# EAGLE schematic adapter_1x1 (EAGLE 6.5.0)
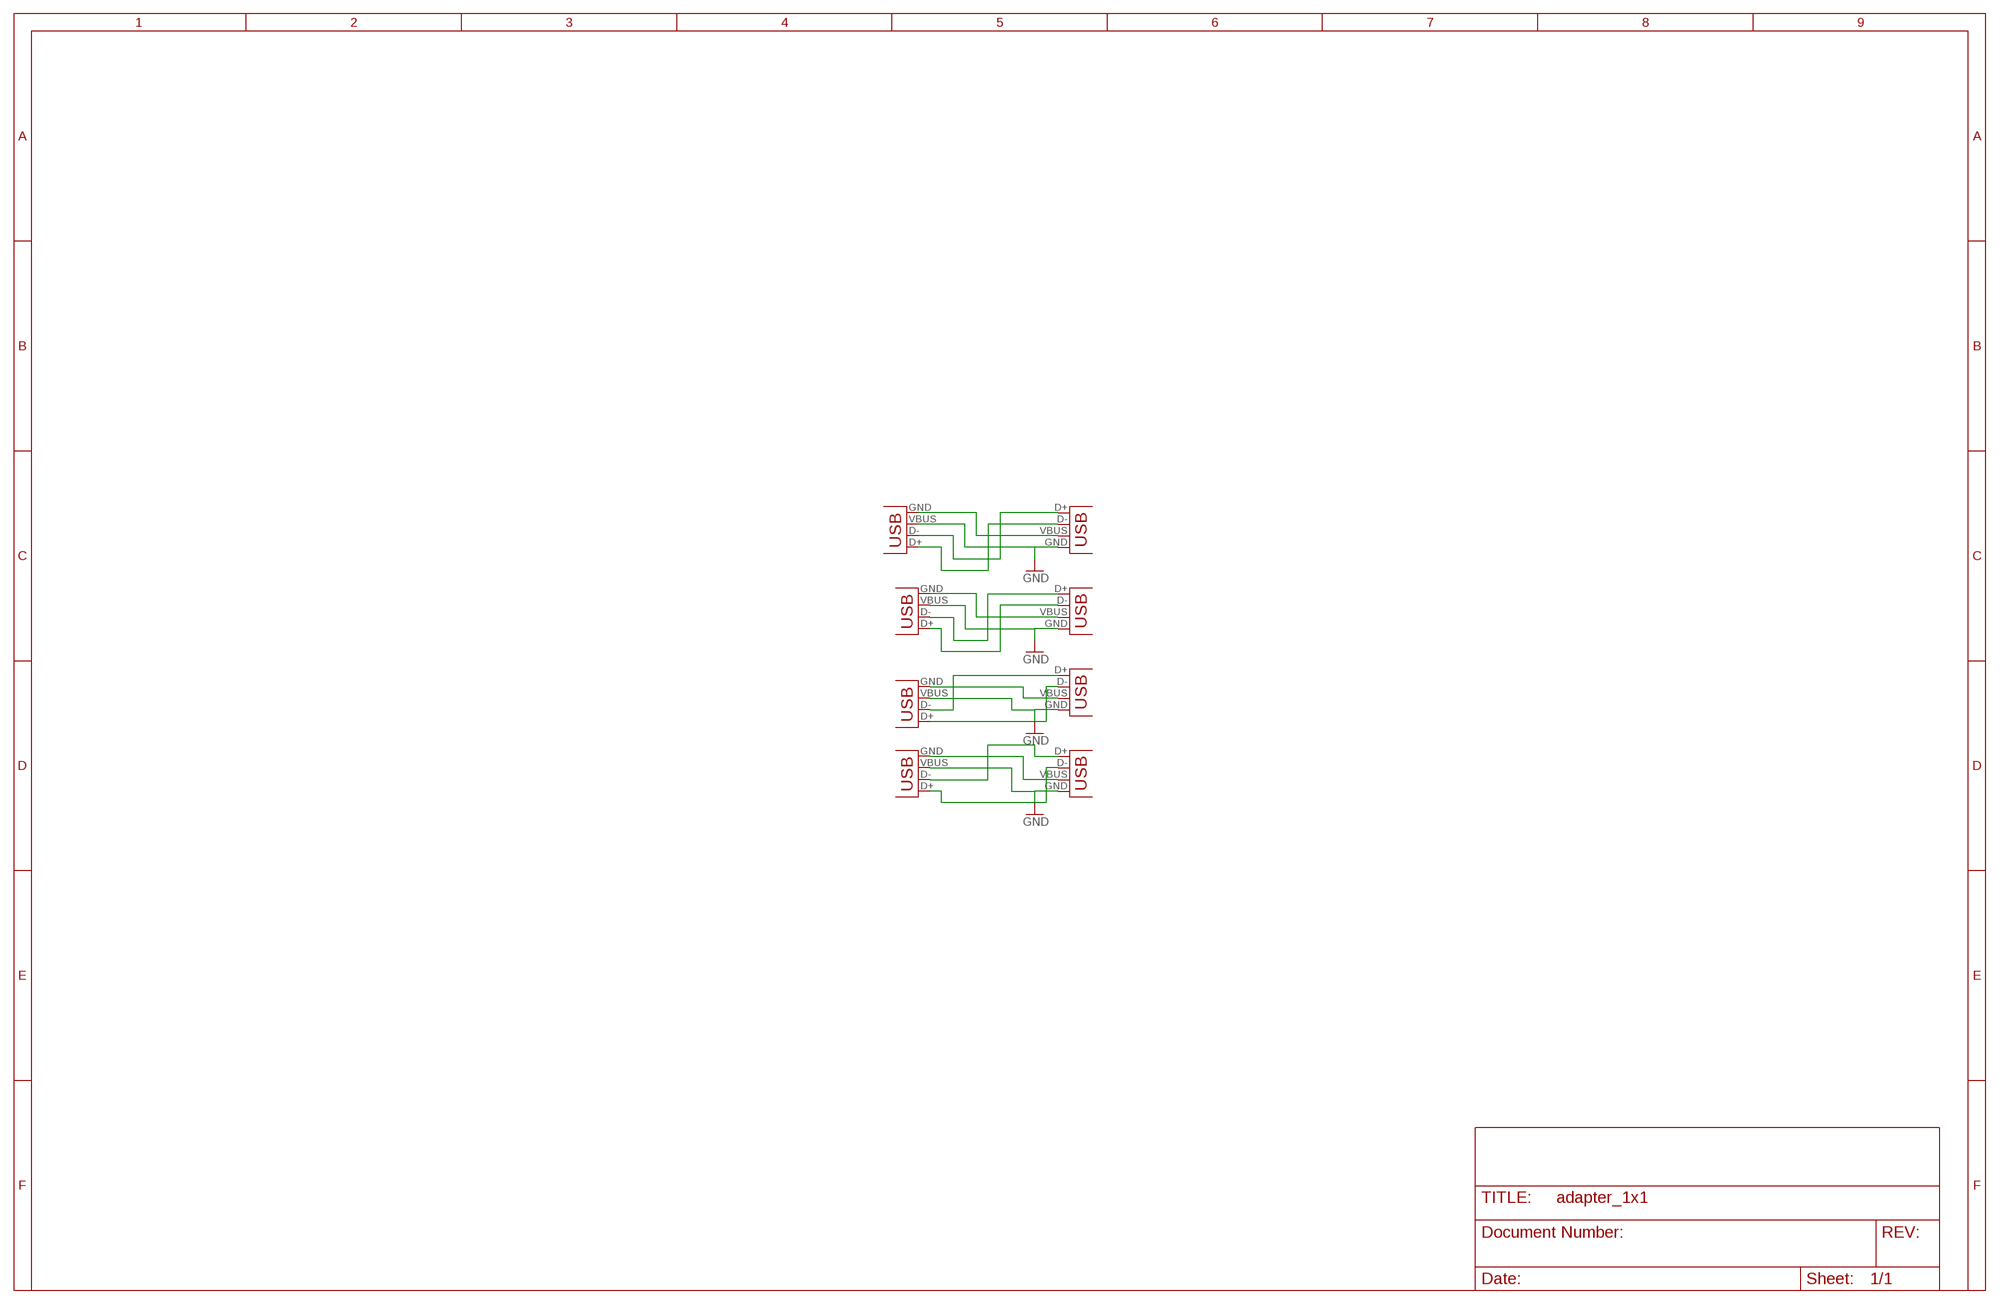
[diagram p0: schematic, sheet 1]

## Parts
X1  USB-A-HU  [USB-A-HU]
X2  USB-A-HU  [USB-A-HU]
X3  USB-A-HU  [USB-A-HU]
X4  USB-A-HU  [USB-A-HU]
X5  USB-A-HU  [USB-A-HU]
X6  USB-A-HU  [USB-A-HU]
X7  USB-A-HU  [USB-A-HU]
X8  USB-A-HU  [USB-A-HU]

## Nets
DM1: X4.D- X5.D+
DP1: X4.D+ X5.D-
GND: X1.GND X2.GND X3.GND X4.GND X5.VBUS X6.VBUS X7.VBUS X8.VBUS
N$1: X1.VBUS X8.GND
N$3: X3.D+ X6.D-
N$4: X3.D- X6.D+
N$6: X2.D+ X7.D-
N$7: X2.D- X7.D+
N$9: X1.D+ X8.D-
N$10: X2.VBUS X7.GND
N$11: X3.VBUS X6.GND
N$12: X4.VBUS X5.GND
N$13: X1.D- X8.D+

## Library data of the parts
X1-X8 = con-usb:USB: USB Connectors